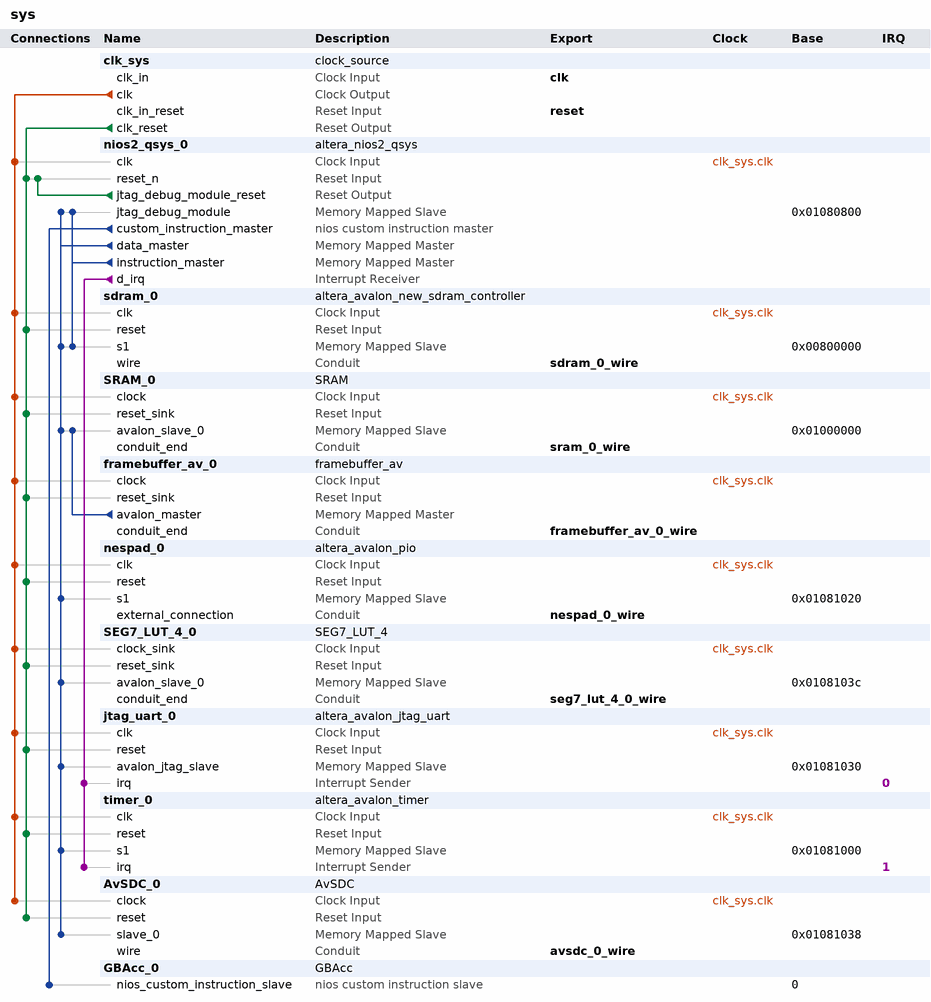
[diagram p0: system contents]
# Platform Designer (Qsys) system sys, Cyclone II EP2C20F484C7
# Parameters at their usual value, and those the tool derives, are not listed.
package require -exact qsys 12.0
create_system sys
set_project_property DEVICE_FAMILY {Cyclone II}
set_project_property DEVICE EP2C20F484C7

add_instance clk_sys clock_source 12.0
set_instance_parameter_value clk_sys clockFrequency 50000000

add_instance nios2_qsys_0 altera_nios2_qsys 12.0
set_instance_parameter_value nios2_qsys_0 manuallyAssignCpuID false
set_instance_parameter_value nios2_qsys_0 resetSlave sdram_0.s1
set_instance_parameter_value nios2_qsys_0 exceptionSlave sdram_0.s1
set_instance_parameter_value nios2_qsys_0 breakSlave nios2_qsys_0.jtag_debug_module
set_instance_parameter_value nios2_qsys_0 impl Fast
set_instance_parameter_value nios2_qsys_0 icache_size 8192
set_instance_parameter_value nios2_qsys_0 icache_burstType Sequential
set_instance_parameter_value nios2_qsys_0 dcache_bursts true
set_instance_parameter_value nios2_qsys_0 dcache_size 4096

add_instance sdram_0 altera_avalon_new_sdram_controller 12.0
set_instance_parameter_value sdram_0 TAC 5.5
set_instance_parameter_value sdram_0 TRCD 20.0
set_instance_parameter_value sdram_0 TRP 20.0
set_instance_parameter_value sdram_0 casLatency 3
set_instance_parameter_value sdram_0 columnWidth 8
set_instance_parameter_value sdram_0 dataWidth 16
set_instance_parameter_value sdram_0 generateSimulationModel false
set_instance_parameter_value sdram_0 model custom
set_instance_parameter_value sdram_0 numberOfBanks 4
set_instance_parameter_value sdram_0 numberOfChipSelects 1
set_instance_parameter_value sdram_0 powerUpDelay 100.0
set_instance_parameter_value sdram_0 refreshPeriod 15.625
set_instance_parameter_value sdram_0 rowWidth 12

add_instance SRAM_0 SRAM 1.0

add_instance framebuffer_av_0 framebuffer_av 1.0

add_instance nespad_0 altera_avalon_pio 12.0
set_instance_parameter_value nespad_0 direction Input
set_instance_parameter_value nespad_0 width 8

add_instance SEG7_LUT_4_0 SEG7_LUT_4 1.0

add_instance jtag_uart_0 altera_avalon_jtag_uart 12.0
set_instance_parameter_value jtag_uart_0 simInteractiveOptions INTERACTIVE_ASCII_OUTPUT

add_instance timer_0 altera_avalon_timer 12.0
set_instance_parameter_value timer_0 period 1
set_instance_parameter_value timer_0 periodUnits MSEC
set_instance_parameter_value timer_0 timerPreset CUSTOM

add_instance AvSDC_0 AvSDC 1.0

add_instance GBAcc_0 GBAcc 1.0

# connections
add_connection clk_sys.clk AvSDC_0.clock clock
add_connection clk_sys.clk framebuffer_av_0.clock clock
add_connection clk_sys.clk jtag_uart_0.clk clock
add_connection clk_sys.clk nespad_0.clk clock
add_connection clk_sys.clk nios2_qsys_0.clk clock
add_connection clk_sys.clk sdram_0.clk clock
add_connection clk_sys.clk SEG7_LUT_4_0.clock_sink clock
add_connection clk_sys.clk SRAM_0.clock clock
add_connection clk_sys.clk timer_0.clk clock
add_connection clk_sys.clk_reset AvSDC_0.reset reset
add_connection clk_sys.clk_reset framebuffer_av_0.reset_sink reset
add_connection clk_sys.clk_reset jtag_uart_0.reset reset
add_connection clk_sys.clk_reset nespad_0.reset reset
add_connection clk_sys.clk_reset nios2_qsys_0.reset_n reset
add_connection clk_sys.clk_reset sdram_0.reset reset
add_connection clk_sys.clk_reset SEG7_LUT_4_0.reset_sink reset
add_connection clk_sys.clk_reset SRAM_0.reset_sink reset
add_connection clk_sys.clk_reset timer_0.reset reset
add_connection nios2_qsys_0.jtag_debug_module_reset nios2_qsys_0.reset_n reset
add_connection framebuffer_av_0.avalon_master SRAM_0.avalon_slave_0 avalon
set_connection_parameter_value framebuffer_av_0.avalon_master/SRAM_0.avalon_slave_0 baseAddress 0x01000000
add_connection nios2_qsys_0.data_master AvSDC_0.slave_0 avalon
set_connection_parameter_value nios2_qsys_0.data_master/AvSDC_0.slave_0 baseAddress 0x01081038
add_connection nios2_qsys_0.data_master jtag_uart_0.avalon_jtag_slave avalon
set_connection_parameter_value nios2_qsys_0.data_master/jtag_uart_0.avalon_jtag_slave baseAddress 0x01081030
add_connection nios2_qsys_0.data_master nespad_0.s1 avalon
set_connection_parameter_value nios2_qsys_0.data_master/nespad_0.s1 baseAddress 0x01081020
add_connection nios2_qsys_0.data_master nios2_qsys_0.jtag_debug_module avalon
set_connection_parameter_value nios2_qsys_0.data_master/nios2_qsys_0.jtag_debug_module baseAddress 0x01080800
add_connection nios2_qsys_0.data_master sdram_0.s1 avalon
set_connection_parameter_value nios2_qsys_0.data_master/sdram_0.s1 baseAddress 0x00800000
add_connection nios2_qsys_0.data_master SEG7_LUT_4_0.avalon_slave_0 avalon
set_connection_parameter_value nios2_qsys_0.data_master/SEG7_LUT_4_0.avalon_slave_0 baseAddress 0x0108103c
add_connection nios2_qsys_0.data_master SRAM_0.avalon_slave_0 avalon
set_connection_parameter_value nios2_qsys_0.data_master/SRAM_0.avalon_slave_0 baseAddress 0x01000000
add_connection nios2_qsys_0.data_master timer_0.s1 avalon
set_connection_parameter_value nios2_qsys_0.data_master/timer_0.s1 baseAddress 0x01081000
add_connection nios2_qsys_0.instruction_master nios2_qsys_0.jtag_debug_module avalon
set_connection_parameter_value nios2_qsys_0.instruction_master/nios2_qsys_0.jtag_debug_module baseAddress 0x01080800
add_connection nios2_qsys_0.instruction_master sdram_0.s1 avalon
set_connection_parameter_value nios2_qsys_0.instruction_master/sdram_0.s1 baseAddress 0x00800000
add_connection nios2_qsys_0.d_irq jtag_uart_0.irq interrupt
set_connection_parameter_value nios2_qsys_0.d_irq/jtag_uart_0.irq irqNumber 0
add_connection nios2_qsys_0.d_irq timer_0.irq interrupt
set_connection_parameter_value nios2_qsys_0.d_irq/timer_0.irq irqNumber 1
add_connection nios2_qsys_0.custom_instruction_master GBAcc_0.nios_custom_instruction_slave nios_custom_instruction
set_connection_parameter_value nios2_qsys_0.custom_instruction_master/GBAcc_0.nios_custom_instruction_slave CIName gbacc_0
set_connection_parameter_value nios2_qsys_0.custom_instruction_master/GBAcc_0.nios_custom_instruction_slave baseAddress 0

# exported interfaces
add_interface clk clock sink
set_interface_property clk EXPORT_OF clk_sys.clk_in
add_interface reset reset sink
set_interface_property reset EXPORT_OF clk_sys.clk_in_reset
add_interface sdram_0_wire conduit end
set_interface_property sdram_0_wire EXPORT_OF sdram_0.wire
add_interface sram_0_wire conduit end
set_interface_property sram_0_wire EXPORT_OF SRAM_0.conduit_end
add_interface framebuffer_av_0_wire conduit end
set_interface_property framebuffer_av_0_wire EXPORT_OF framebuffer_av_0.conduit_end
add_interface nespad_0_wire conduit end
set_interface_property nespad_0_wire EXPORT_OF nespad_0.external_connection
add_interface seg7_lut_4_0_wire conduit end
set_interface_property seg7_lut_4_0_wire EXPORT_OF SEG7_LUT_4_0.conduit_end
add_interface avsdc_0_wire conduit end
set_interface_property avsdc_0_wire EXPORT_OF AvSDC_0.wire

save_system sys.qsys
